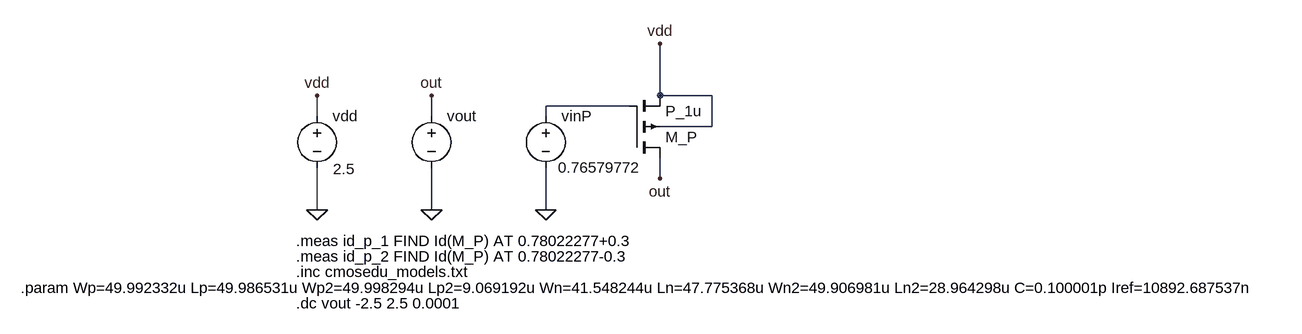
[diagram p0: schematic R7.asc]
R7.asc, the LTspice schematic file:
Version 4
SHEET 1 1724 680
WIRE 512 -48 512 -128
WIRE 592 -48 512 -48
WIRE 464 -32 336 -32
WIRE -16 -16 -16 -48
WIRE 160 -16 160 -48
WIRE 336 -16 336 -32
WIRE 592 0 592 -48
WIRE 592 0 512 0
WIRE 512 80 512 48
WIRE -16 128 -16 64
WIRE 160 128 160 64
WIRE 336 128 336 64
FLAG 512 -128 vdd
FLAG 336 128 0
FLAG 160 128 0
FLAG 160 -48 out
FLAG 512 80 out
FLAG -16 128 0
FLAG -16 -48 vdd
SYMBOL pmos4 464 48 M180
SYMATTR InstName M_P
SYMATTR Value2 l={Lp} w={Wp}
SYMATTR Value P_1u
SYMBOL voltage 336 -32 R0
WINDOW 3 19 95 Left 2
WINDOW 123 0 0 Left 2
WINDOW 39 0 0 Left 2
SYMATTR Value 0.76579772
SYMATTR InstName vinP
SYMBOL voltage 160 -32 R0
WINDOW 123 0 0 Left 2
WINDOW 39 0 0 Left 2
WINDOW 3 17 99 Left 2
SYMATTR Value ""
SYMATTR InstName vout
SYMBOL voltage -16 -32 R0
WINDOW 123 0 0 Left 2
WINDOW 39 0 0 Left 2
WINDOW 3 25 97 Left 2
SYMATTR Value 2.5
SYMATTR InstName vdd
TEXT -48 224 Left 2 !.inc cmosedu_models.txt
TEXT -48 272 Left 2 !.dc vout -2.5 2.5 0.0001
TEXT -48 176 Left 2 !.meas id_p_1 FIND Id(M_P) AT 0.78022277+0.3
TEXT -48 200 Left 2 !.meas id_p_2 FIND Id(M_P) AT 0.78022277-0.3
TEXT -472 248 Left 2 !.param Wp=49.992332u Lp=49.986531u Wp2=49.998294u Lp2=9.069192u Wn=41.548244u Ln=47.775368u Wn2=49.906981u Ln2=28.964298u C=0.100001p Iref=10892.687537n

The netlist it stands for:
* R7.asc
M_P out N001 vdd vdd P_1u l={Lp} w={Wp}
vinP N001 0 0.76579772
vout out 0
vdd vdd 0 2.5
.model NMOS NMOS
.model PMOS PMOS
.lib standard.mos
.inc cmosedu_models.txt
.dc vout -2.5 2.5 0.0001
.meas id_p_1 FIND Id(M_P) AT 0.78022277+0.3
.meas id_p_2 FIND Id(M_P) AT 0.78022277-0.3
.param Wp=49.992332u Lp=49.986531u Wp2=49.998294u Lp2=9.069192u Wn=41.548244u Ln=47.775368u Wn2=49.906981u Ln2=28.964298u C=0.100001p Iref=10892.687537n
.backanno
.end